# Altium schematic sheet 01_Project_Information.SchDoc: =project_title
size Tabloid; CompanyName: Luxonis Holding; Organization: Luxonis Holding; Address1: 1925 Harmony Park Drive; Address2: Westminster, CO; Address3: 80234; Address4: United States; SheetNumber: 1; SheetTotal: 3
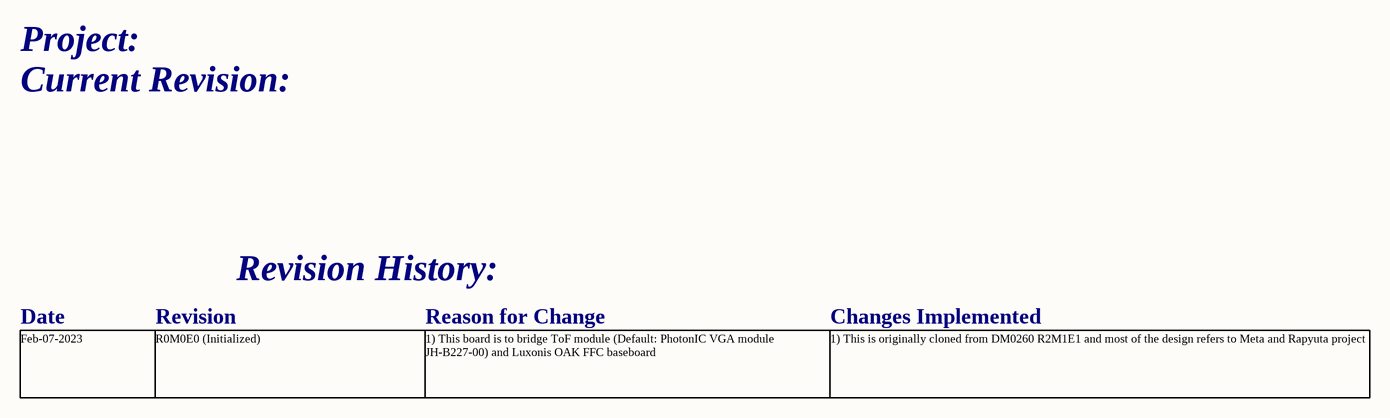
[diagram p0: 01_Project_Information.SchDoc]

## Notes on the sheet
- Project:
- Current Revision:
- Revision History:
- Date
- Revision
- Reason for Change
- Changes Implemented
- Feb-07-2023
- R0M0E0 (Initialized)
- 1) This board is to bridge ToF module (Default: PhotonIC VGA module JH-B227-00) and Luxonis OAK FFC baseboard
- 1) This is originally cloned from DM0260 R2M1E1 and most of the design refers to Meta and Rapyuta project
- Title
- Size:
- Date:
- Tabloid
- Number:
- Time:
- Revision:
- Sheet
- of
- Drawn by: